# EAGLE schematic GEVCU-4.2 (EAGLE 6.1)
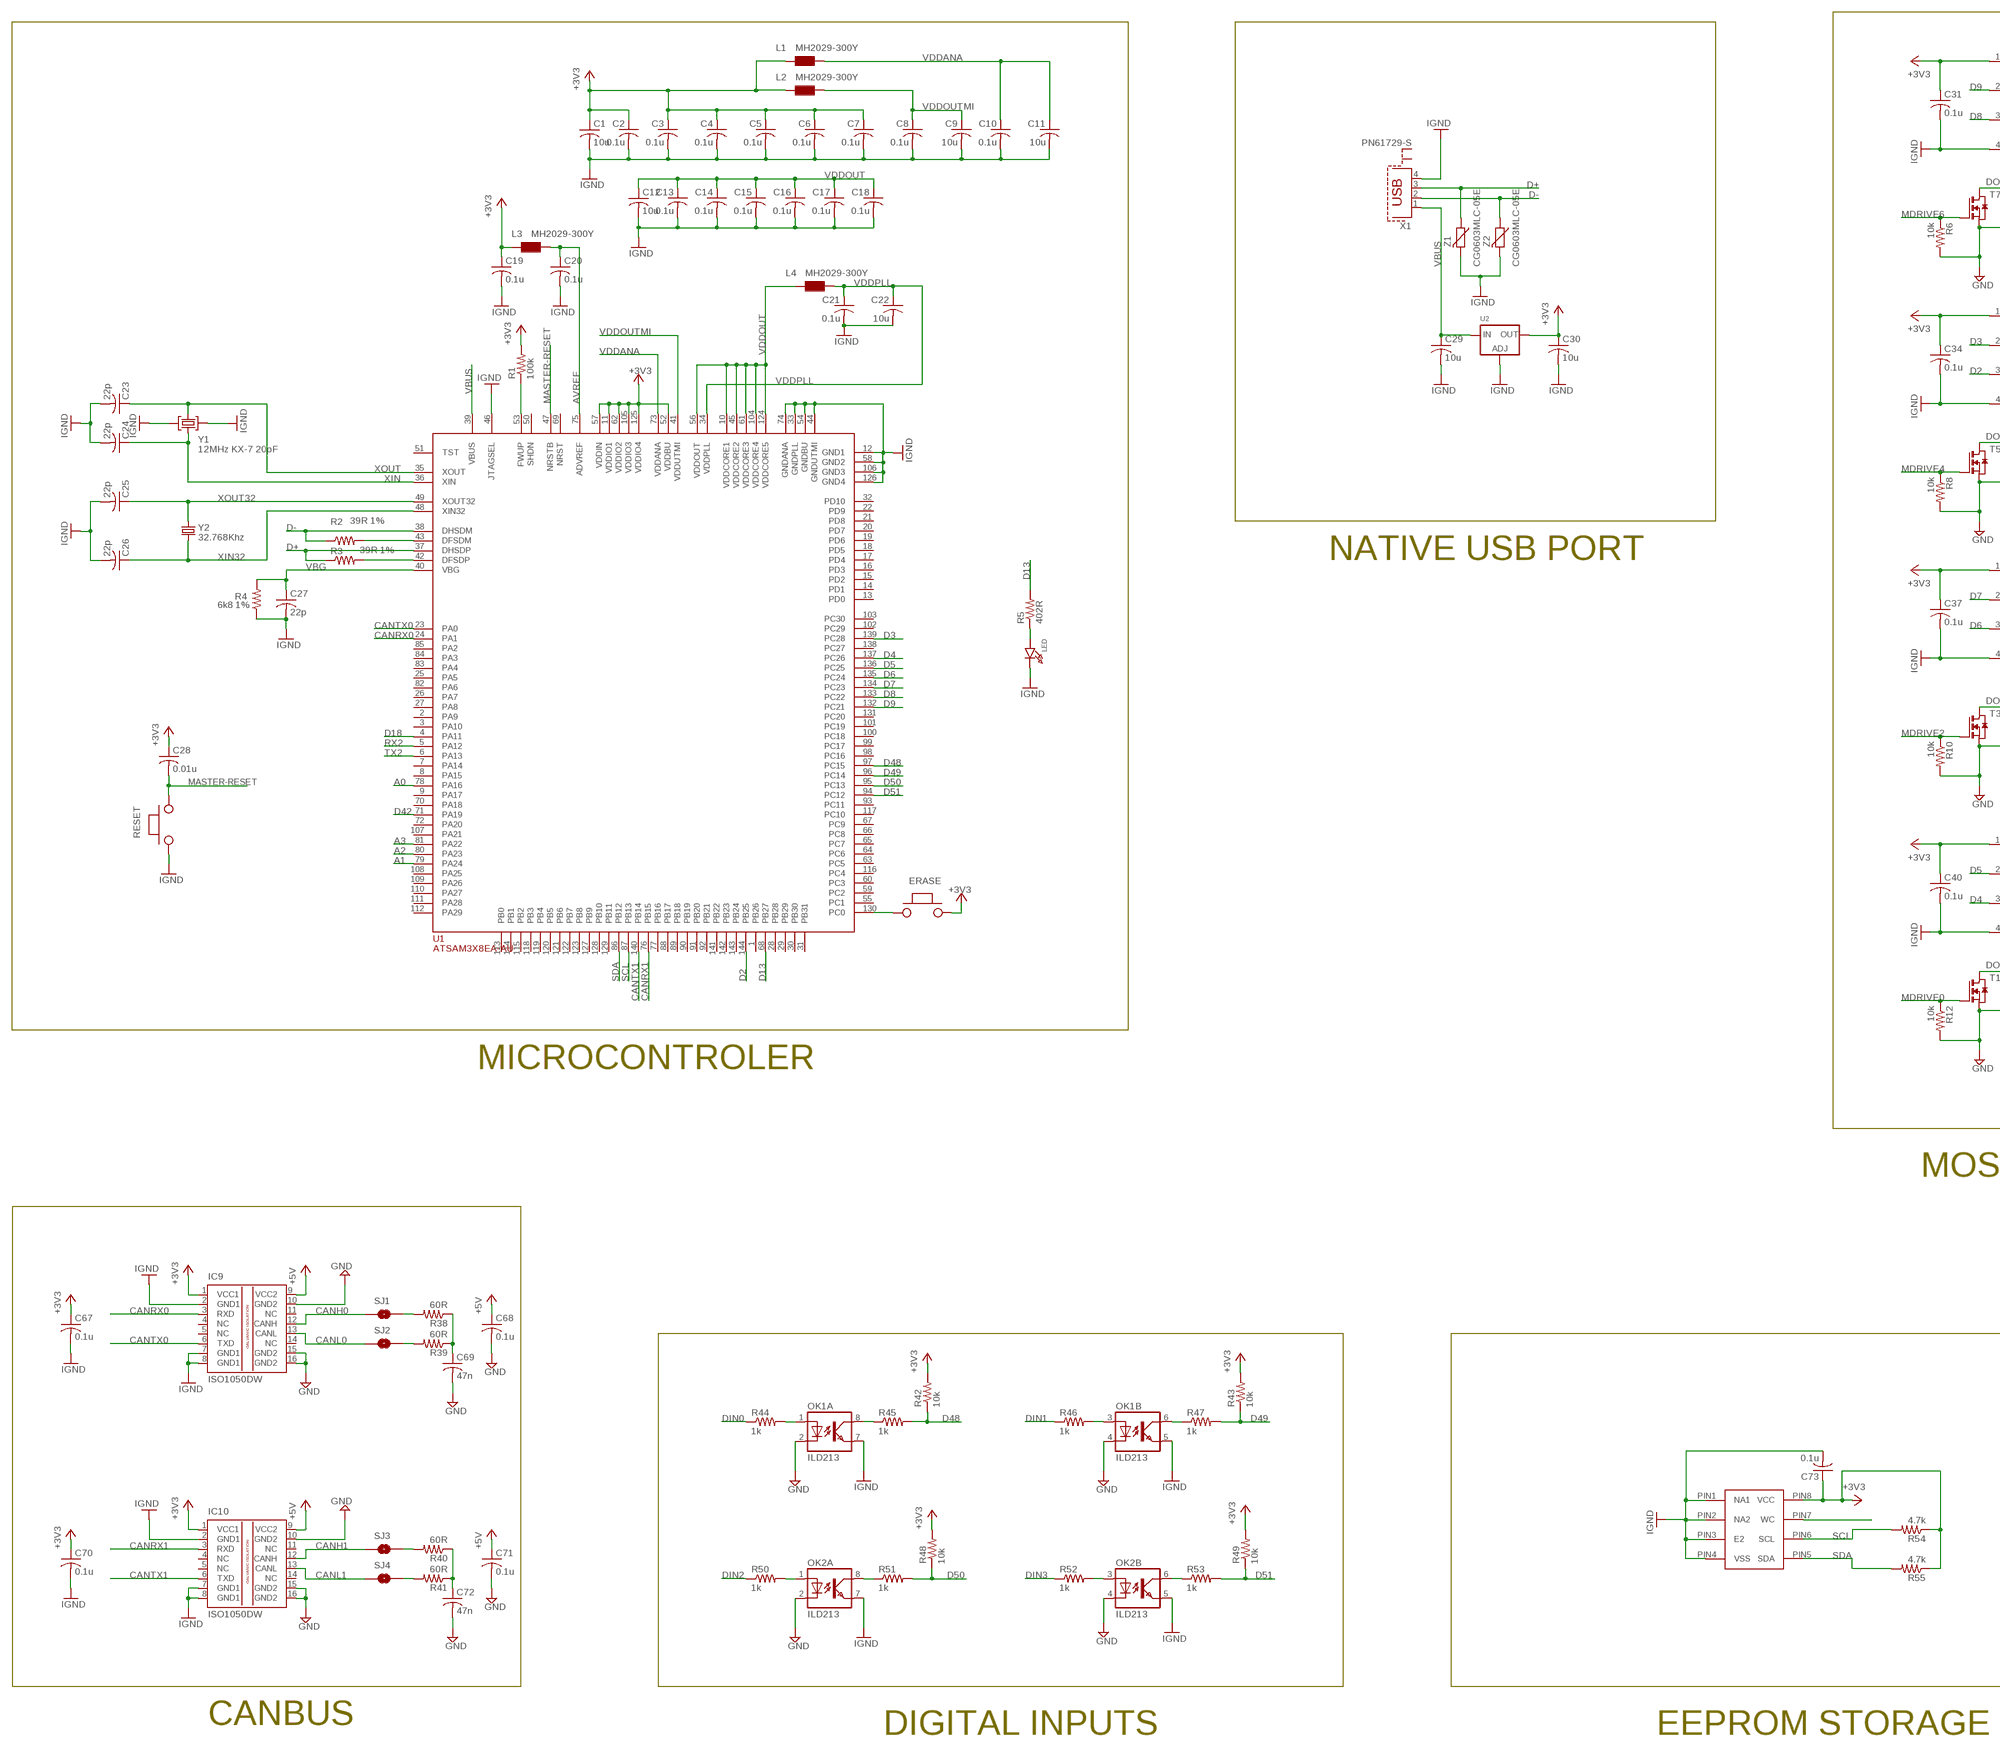
[diagram p0: schematic, sheet 1, part 1 of 2]
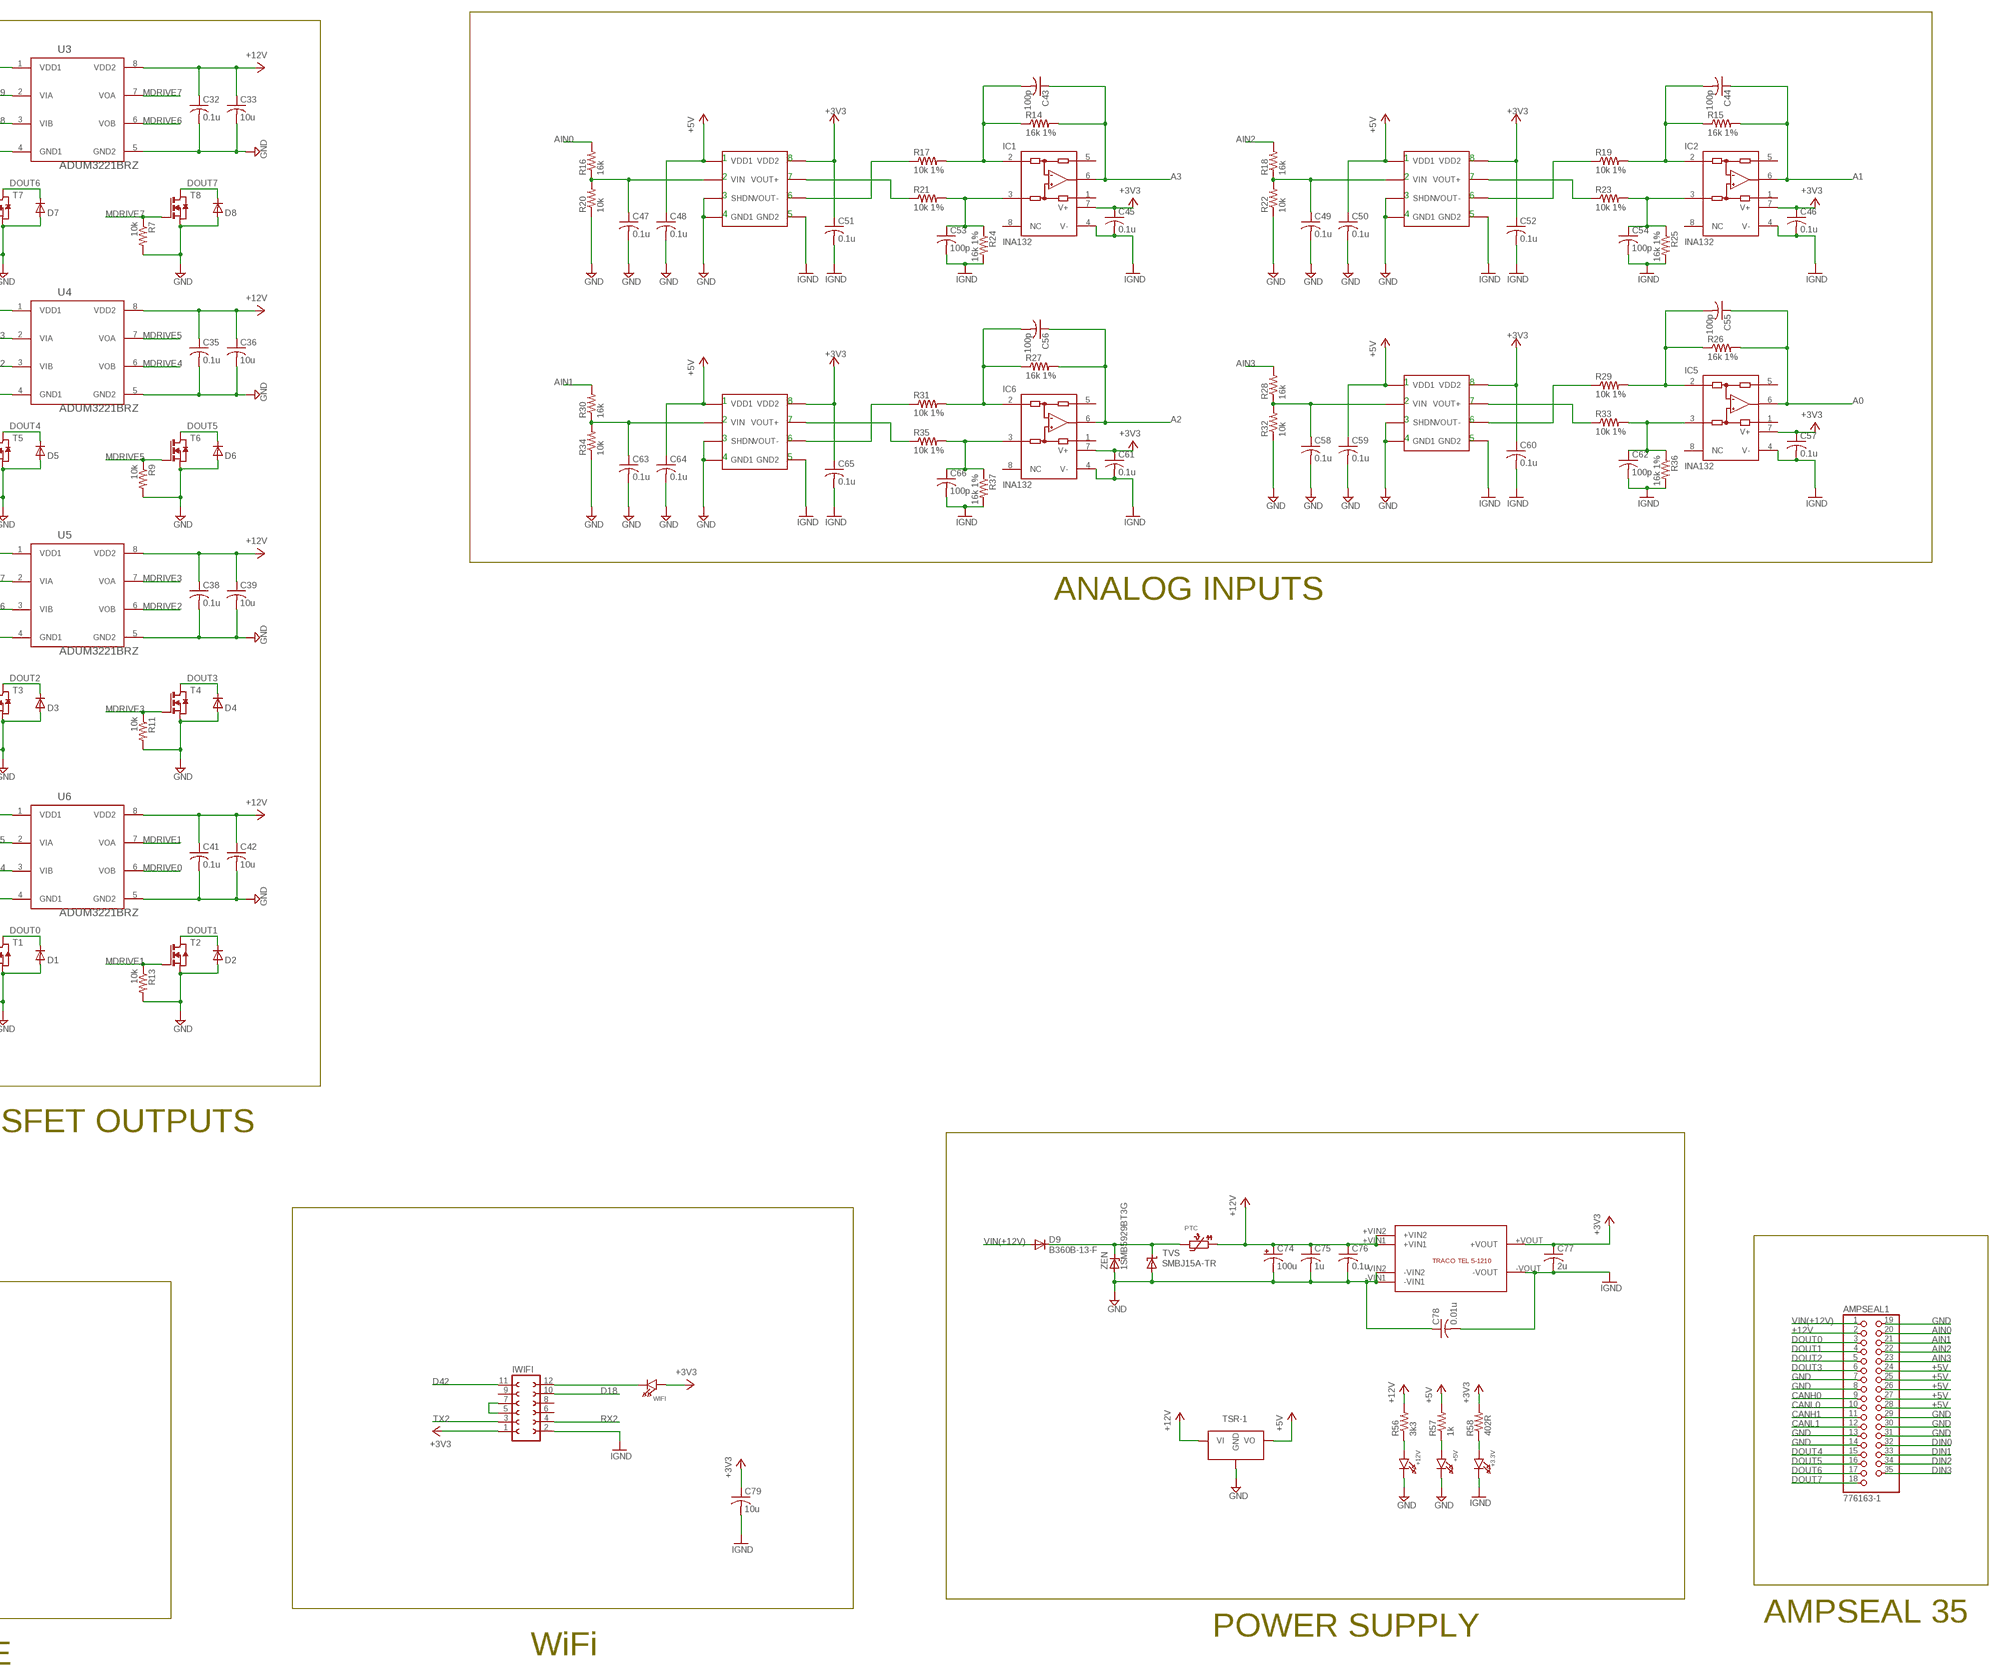
[diagram p1: schematic, sheet 1, part 2 of 2]

## Parts
+3.3V  LED0805  [CHIPLED_0805]
+5V  LED0805  [CHIPLED_0805]
+12V  LED0805  [CHIPLED_0805]
AMPSEAL1  776163-1  AMPSEAL35  [AMPSEAL35]
C1  10u  C-USC0805  [C0805]
C2  0.1u  C-USC0805  [C0805]
C3  0.1u  C-USC0805  [C0805]
C4  0.1u  C-USC0805  [C0805]
C5  0.1u  C-USC0805  [C0805]
C6  0.1u  C-USC0805  [C0805]
C7  0.1u  C-USC0805  [C0805]
C8  0.1u  C-USC0805  [C0805]
C9  10u  C-USC0805  [C0805]
C10  0.1u  C-USC0805  [C0805]
C11  10u  C-USC0805  [C0805]
C12  10u  C-USC0805  [C0805]
C13  0.1u  C-USC0805  [C0805]
C14  0.1u  C-USC0805  [C0805]
C15  0.1u  C-USC0805  [C0805]
C16  0.1u  C-USC0805  [C0805]
C17  0.1u  C-USC0805  [C0805]
C18  0.1u  C-USC0805  [C0805]
C19  0.1u  C-USC0805  [C0805]
C20  0.1u  C-USC0805  [C0805]
C21  0.1u  C-USC0805  [C0805]
C22  10u  C-USC0805  [C0805]
C23  22p  C-USC1206  [C1206]
C24  22p  C-USC1206  [C1206]
C25  22p  C-USC0805  [C0805]
C26  22p  C-USC0805  [C0805]
C27  22p  C-USC0805  [C0805]
C28  0.01u  C-USC0805  [C0805]
C29  10u  C-USC0805  [C0805]
C30  10u  C-USC0805  [C0805]
C31  0.1u  C-USC0805  [C0805]
C32  0.1u  C-USC0805  [C0805]
C33  10u  C-USC0805  [C0805]
C34  0.1u  C-USC0805  [C0805]
C35  0.1u  C-USC0805  [C0805]
C36  10u  C-USC0805  [C0805]
C37  0.1u  C-USC0805  [C0805]
C38  0.1u  C-USC0805  [C0805]
C39  10u  C-USC0805  [C0805]
C40  0.1u  C-USC0805  [C0805]
C41  0.1u  C-USC0805  [C0805]
C42  10u  C-USC0805  [C0805]
C43  100p  C-USC0805  [C0805]
C44  100p  C-USC0805  [C0805]
C45  0.1u  C-USC0805  [C0805]
C46  0.1u  C-USC0805  [C0805]
C47  0.1u  C-USC0805  [C0805]
C48  0.1u  C-USC1206  [C1206]
C49  0.1u  C-USC0805  [C0805]
C50  0.1u  C-USC1206  [C1206]
C51  0.1u  C-USC0805  [C0805]
C52  0.1u  C-USC0805  [C0805]
C53  100p  C-USC0805  [C0805]
C54  100p  C-USC0805  [C0805]
C55  100p  C-USC0805  [C0805]
C56  100p  C-USC0805  [C0805]
C57  0.1u  C-USC0805  [C0805]
C58  0.1u  C-USC0805  [C0805]
C59  0.1u  C-USC1206  [C1206]
C60  0.1u  C-USC0805  [C0805]
C61  0.1u  C-USC0805  [C0805]
C62  100p  C-USC0805  [C0805]
C63  0.1u  C-USC0805  [C0805]
C64  0.1u  C-USC1206  [C1206]
C65  0.1u  C-USC0805  [C0805]
C66  100p  C-USC0805  [C0805]
C67  0.1u  C-USC0805  [C0805]
C68  0.1u  C-USC0805  [C0805]
C69  47n  C-USC0805  [C0805]
C70  0.1u  C-USC0805  [C0805]
C71  0.1u  C-USC0805  [C0805]
C72  47n  C-USC0805  [C0805]
C73  0.1u  C-USC0805  [C0805]
C74  100u  CPOL-USE2.5-6  [E2,5-6]
C75  1u  C-USC0805  [C0805]
C76  0.1u  C-USC0805  [C0805]
C77  2u  C-USC0805  [C0805]
C78  0.01u  C-USC1812  [C1812]
C79  10u  C-USC0805  [C0805]
D1  MBR0520LT  [SOD123]
D2  MBR0520LT  [SOD123]
D3  MBR0520LT  [SOD123]
D4  MBR0520LT  [SOD123]
D5  MBR0520LT  [SOD123]
D6  MBR0520LT  [SOD123]
D7  MBR0520LT  [SOD123]
D8  MBR0520LT  [SOD123]
D9  B360B-13-F  DIODE-SMB  [SMB]
ERASE  PUCHBUTTON  [PUCHBUTTON]
IC1  INA132  INA105U  [SO08]
IC2  INA132  INA105U  [SO08]
IC3  CK_CUSTOM_ACPL-C87A-000E  [CK_CUSTOM_SO8-WIDE]
IC4  CK_CUSTOM_ACPL-C87A-000E  [CK_CUSTOM_SO8-WIDE]
IC5  INA132  INA105U  [SO08]
IC6  INA132  INA105U  [SO08]
IC7  CK_CUSTOM_ACPL-C87A-000E  [CK_CUSTOM_SO8-WIDE]
IC8  CK_CUSTOM_ACPL-C87A-000E  [CK_CUSTOM_SO8-WIDE]
IC9  ISO1050DW  ISO1050DUB  [DUB-R-PDSO-G8]
IC10  ISO1050DW  ISO1050DUB  [DUB-R-PDSO-G8]
IWIFI  FE06-2  [FE06-2]
L1  MH2029-300Y  WE-CBF_0805  [0805]
L2  MH2029-300Y  WE-CBF_0805  [0805]
L3  MH2029-300Y  WE-CBF_0805  [0805]
L4  MH2029-300Y  WE-CBF_0805  [0805]
LED  LED0805  [CHIPLED_0805]
OK1  ILD213  [SOIC08]
OK2  ILD213  [SOIC08]
PTC  PTC1812  [PTC1812]
R1  100k  R-US_R0805  [R0805]
R2  39R 1%  R-US_R0805  [R0805]
R3  39R 1%  R-US_R0805  [R0805]
R4  6k8 1%  R-US_R0805  [R0805]
R5  402R  R-US_R0805  [R0805]
R6  10k  R-US_R0805  [R0805]
R7  10k  R-US_R0805  [R0805]
R8  10k  R-US_R0805  [R0805]
R9  10k  R-US_R0805  [R0805]
R10  10k  R-US_R0805  [R0805]
R11  10k  R-US_R0805  [R0805]
R12  10k  R-US_R0805  [R0805]
R13  10k  R-US_R0805  [R0805]
R14  16k 1%  R-US_R0805  [R0805]
R15  16k 1%  R-US_R0805  [R0805]
R16  16k  R-US_R0805  [R0805]
R17  10k 1%  R-US_R0805  [R0805]
R18  16k  R-US_R0805  [R0805]
R19  10k 1%  R-US_R0805  [R0805]
R20  10k  R-US_R0805  [R0805]
R21  10k 1%  R-US_R0805  [R0805]
R22  10k  R-US_R0805  [R0805]
R23  10k 1%  R-US_R0805  [R0805]
R24  16k 1%  R-US_R0805  [R0805]
R25  16k 1%  R-US_R0805  [R0805]
R26  16k 1%  R-US_R0805  [R0805]
R27  16k 1%  R-US_R0805  [R0805]
R28  16k  R-US_R0805  [R0805]
R29  10k 1%  R-US_R0805  [R0805]
R30  16k  R-US_R0805  [R0805]
R31  10k 1%  R-US_R0805  [R0805]
R32  10k  R-US_R0805  [R0805]
R33  10k 1%  R-US_R0805  [R0805]
R34  10k  R-US_R0805  [R0805]
R35  10k 1%  R-US_R0805  [R0805]
R36  16k 1%  R-US_R0805  [R0805]
R37  16k 1%  R-US_R0805  [R0805]
R38  60R  R-US_R0805  [R0805]
R39  60R  R-US_R0805  [R0805]
R40  60R  R-US_R0805  [R0805]
R41  60R  R-US_R0805  [R0805]
R42  10k  R-US_R0805  [R0805]
R43  10k  R-US_R0805  [R0805]
R44  1k  R-US_R0805  [R0805]
R45  1k  R-US_R0805  [R0805]
R46  1k  R-US_R0805  [R0805]
R47  1k  R-US_R0805  [R0805]
R48  10k  R-US_R0805  [R0805]
R49  10k  R-US_R0805  [R0805]
R50  1k  R-US_R0805  [R0805]
R51  1k  R-US_R0805  [R0805]
R52  1k  R-US_R0805  [R0805]
R53  1k  R-US_R0805  [R0805]
R54  4.7k  R-US_R0805  [R0805]
R55  4.7k  R-US_R0805  [R0805]
R56  3k3  R-US_R0805  [R0805]
R57  1k  R-US_R0805  [R0805]
R58  402R  R-US_R0805  [R0805]
RESET  PUCHBUTTON  [PUCHBUTTON]
SJ1  SOLDERJUMPERNO  [SJ_2S-NO]
SJ2  SOLDERJUMPERNO  [SJ_2S-NO]
SJ3  SOLDERJUMPERNO  [SJ_2S-NO]
SJ4  SOLDERJUMPERNO  [SJ_2S-NO]
T1  NMOSSOT223  [SOT223]
T2  NMOSSOT223  [SOT223]
T3  NMOSSOT223  [SOT223]
T4  NMOSSOT223  [SOT223]
T5  NMOSSOT223  [SOT223]
T6  NMOSSOT223  [SOT223]
T7  NMOSSOT223  [SOT223]
T8  NMOSSOT223  [SOT223]
TVS  SMBJ15A-TR  SUPPRESSOR-SMBJ  [SMBJ]
U1  ATSAM3X8EA-AU  ATSAM3X/AAU  [LQFP144]
U2  LM1117SOT223-WAVE  [SOT223-W]
U3  ADUM3221BRZ  [SOIC127P600X175-8N]
U4  ADUM3221BRZ  [SOIC127P600X175-8N]
U5  ADUM3221BRZ  [SOIC127P600X175-8N]
U6  ADUM3221BRZ  [SOIC127P600X175-8N]
U7  CK_CUSTOM_M24M02-DRMN6TP  [CK_CUSTOM_SOIC8]
U8  TRACO  [TRACO]
U9  TSR-1  [TSR-1]
WIFI  LED0805  [CHIPLED_0805]
X1  PN61729-S  [PN61729-S]
Y1  12MHz KX-7 20pF  CRYSTAL-3.2-2.5  [CRYSTAL-3.2-2.5]
Y2  32.768Khz  ARDUINO_WIFI_SHIELD_V018_TG_RESONATOR_EPSON_FC_145  [ARDUINO_WIFI_SHIELD_V018_TG_RESONATOR_EPSON_FC_145]
Z1  CG0603MLC-05E  VARISTORCN0603  [CT/CN0603]
Z2  CG0603MLC-05E  VARISTORCN0603  [CT/CN0603]
ZEN  1SMB5929BT3G  ZENER-DIODESMB  [SMB]

## Nets
+3V3: C1.1 C2.1 C3.1 C4.1 C5.1 C6.1 C7.1 C19.1 C28.1 C30.1 C31.1 C34.1 C37.1 C40.1 C45.1 C46.1 C51.1 C52.1 C57.1 C60.1 C61.1 C65.1 C67.1 C70.1 C73.1 C77.1 C79.1 ERASE.P$2 IC1.7(V+) IC2.7(V+) IC3.8(VDD2) IC4.8(VDD2) IC5.7(V+) IC6.7(V+) IC7.8(VDD2) IC8.8(VDD2) IC9.1(VCC1) IC10.1(VCC1) IWIFI.1 L1.1 L2.1 L3.1 R1.2 R42.2 R43.2 R48.2 R49.2 R54.1 R55.1 R58.2 U1.11(VDDIO1) U1.52(VDDBU) U1.57(VDDIN) U1.62(VDDIO2) U1.105(VDDIO3) U1.125(VDDIO4) U2.2(OUT) U3.1(VDD1) U4.1(VDD1) U5.1(VDD1) U6.1(VDD1) U7.PIN8(VCC) U8.+VOUT WIFI.A
+5V: AMPSEAL1.24 AMPSEAL1.25 AMPSEAL1.26 AMPSEAL1.27 AMPSEAL1.28 C48.1 C50.1 C59.1 C64.1 C68.1 C71.1 IC3.1(VDD1) IC4.1(VDD1) IC7.1(VDD1) IC8.1(VDD1) IC9.9(VCC2) IC10.9(VCC2) R57.2 U9.P$3(VO)
+12V: AMPSEAL1.2 C32.1 C33.1 C35.1 C36.1 C38.1 C39.1 C41.1 C42.1 C74.+ C75.1 C76.1 PTC.P$1 R56.2 U3.8(VDD2) U4.8(VDD2) U5.8(VDD2) U6.8(VDD2) U8.+VIN1 U8.+VIN2 U9.P$1(VI)
A0: C55.1 IC5.6(OUT) R26.2 U1.78(PA16)
A1: C44.1 IC2.6(OUT) R15.2 U1.79(PA24)
A2: C56.1 IC6.6(OUT) R27.2 U1.80(PA23)
A3: C43.1 IC1.6(OUT) R14.2 U1.81(PA22)
AIN0: AMPSEAL1.20 R16.2
AIN1: AMPSEAL1.21 R30.2
AIN2: AMPSEAL1.22 R18.2
AIN3: AMPSEAL1.23 R28.2
AVREF: C20.1 L3.2 U1.75(ADVREF)
CANH0: AMPSEAL1.9 IC9.12(CANH) SJ1.1
CANH1: AMPSEAL1.11 IC10.12(CANH) SJ3.1
CANL0: AMPSEAL1.10 IC9.13(CANL) SJ2.1
CANL1: AMPSEAL1.12 IC10.13(CANL) SJ4.1
CANRX0: IC9.3(RXD) U1.24(PA1)
CANRX1: IC10.3(RXD) U1.76(PB15)
CANTX0: IC9.6(TXD) U1.23(PA0)
CANTX1: IC10.6(TXD) U1.140(PB14)
D2: U1.144(PB25) U4.3(VIB)
D3: U1.139(PC28) U4.2(VIA)
D4: U1.137(PC26) U6.3(VIB)
D5: U1.136(PC25) U6.2(VIA)
D6: U1.135(PC24) U5.3(VIB)
D7: U1.134(PC23) U5.2(VIA)
D8: U1.133(PC22) U3.3(VIB)
D9: U1.132(PC21) U3.2(VIA)
D13: R5.2 U1.68(PB27)
D18: IWIFI.10 U1.4(PA11)
D42: IWIFI.11 U1.71(PA19)
D48: R42.1 R45.2 U1.97(PC15)
D49: R43.1 R47.2 U1.96(PC14)
D50: R48.1 R51.2 U1.95(PC13)
D51: R49.1 R53.2 U1.94(PC12)
D+ [USB]: R3.1 U1.37(DHSDP) X1.3 Z1.1
D- [USB]: R2.1 U1.38(DHSDM) X1.2 Z2.1
DIN0: AMPSEAL1.32 R44.1
DIN1: AMPSEAL1.33 R46.1
DIN2: AMPSEAL1.34 R50.1
DIN3: AMPSEAL1.35 R52.1
DOUT0: AMPSEAL1.3 D1.C T1.2(D) T1.4(D)
DOUT1: AMPSEAL1.4 D2.C T2.2(D) T2.4(D)
DOUT2: AMPSEAL1.5 D3.C T3.2(D) T3.4(D)
DOUT3: AMPSEAL1.6 D4.C T4.2(D) T4.4(D)
DOUT4: AMPSEAL1.15 D5.C T5.2(D) T5.4(D)
DOUT5: AMPSEAL1.16 D6.C T6.2(D) T6.4(D)
DOUT6: AMPSEAL1.17 D7.C T7.2(D) T7.4(D)
DOUT7: AMPSEAL1.18 D8.C T8.2(D) T8.4(D)
ERASE_S: ERASE.P$1 U1.130(PC0)
GND: +5V.C +12V.C AMPSEAL1.7 AMPSEAL1.8 AMPSEAL1.13 AMPSEAL1.14 AMPSEAL1.19 AMPSEAL1.29 AMPSEAL1.30 AMPSEAL1.31 C32.2 C33.2 C35.2 C36.2 C38.2 C39.2 C41.2 C42.2 C47.2 C48.2 C49.2 C50.2 C58.2 C59.2 C63.2 C64.2 C68.2 C69.2 C71.2 C72.2 C74.- C75.2 C76.2 C78.1 D1.A D2.A D3.A D4.A D5.A D6.A D7.A D8.A IC3.3(SHDN) IC3.4(GND1) IC4.3(SHDN) IC4.4(GND1) IC7.3(SHDN) IC7.4(GND1) IC8.3(SHDN) IC8.4(GND1) IC9.10(GND2) IC9.15(GND2) IC9.16(GND2) IC10.10(GND2) IC10.15(GND2) IC10.16(GND2) OK1.2(A:C) OK1.4(B:C) OK2.2(A:C) OK2.4(B:C) R6.2 R7.2 R8.2 R9.2 R10.2 R11.2 R12.2 R13.2 R20.1 R22.1 R32.1 R34.1 T1.3(S) T2.3(S) T3.3(S) T4.3(S) T5.3(S) T6.3(S) T7.3(S) T8.3(S) TVS.A U3.5(GND2) U4.5(GND2) U5.5(GND2) U6.5(GND2) U8.-VIN1 U8.-VIN2 U9.P$2(GND) ZEN.A
IGND: +3.3V.C C1.2 C2.2 C3.2 C4.2 C5.2 C6.2 C7.2 C8.2 C9.2 C10.2 C11.2 C12.2 C13.2 C14.2 C15.2 C16.2 C17.2 C18.2 C19.2 C20.2 C21.2 C22.2 C23.2 C24.2 C25.2 C26.2 C27.2 C29.2 C30.2 C31.2 C34.2 C37.2 C40.2 C45.2 C46.2 C51.2 C52.2 C53.2 C54.2 C57.2 C60.2 C61.2 C62.2 C65.2 C66.2 C67.2 C70.2 C73.2 C77.2 C78.2 C79.2 IC1.4(V-) IC2.4(V-) IC3.5(GND2) IC4.5(GND2) IC5.4(V-) IC6.4(V-) IC7.5(GND2) IC8.5(GND2) IC9.2(GND1) IC9.7(GND1) IC9.8(GND1) IC10.2(GND1) IC10.7(GND1) IC10.8(GND1) IWIFI.2 LED.C OK1.5(B:EMIT) OK1.7(A:EMIT) OK2.5(B:EMIT) OK2.7(A:EMIT) R4.1 R24.2 R25.2 R36.2 R37.2 RESET.P$1 U1.12(GND1) U1.33(GNDPLL) U1.44(GNDUTMI) U1.46(JTAGSEL) U1.54(GNDBU) U1.58(GND2) U1.74(GNDANA) U1.106(GND3) U1.126(GND4) U2.1(ADJ) U3.4(GND1) U4.4(GND1) U5.4(GND1) U6.4(GND1) U7.PIN1(NA1) U7.PIN2(NA2) U7.PIN3(E2) U7.PIN4(VSS) U8.-VOUT X1.4 Y1.2(GND) Y1.4(GND) Z1.2 Z2.2
MASTER-RESET: C28.2 RESET.P$2 U1.47(NRSTB)
MDRIVE0: R12.1 T1.1(G) U6.6(VOB)
MDRIVE1: R13.1 T2.1(G) U6.7(VOA)
MDRIVE2: R10.1 T3.1(G) U5.6(VOB)
MDRIVE3: R11.1 T4.1(G) U5.7(VOA)
MDRIVE4: R8.1 T5.1(G) U4.6(VOB)
MDRIVE5: R9.1 T6.1(G) U4.7(VOA)
MDRIVE6: R6.1 T7.1(G) U3.6(VOB)
MDRIVE7: R7.1 T8.1(G) U3.7(VOA)
N$1: C47.1 IC3.2(VIN) R16.1 R20.2
N$2: +3.3V.A R58.1
N$3: D9.C PTC.P$2 TVS.C ZEN.C
N$4: +5V.A R57.1
N$6: LED.A R5.1
N$8: IC8.7(VOUT+) R35.1
N$9: IC8.6(VOUT-) R31.1
N$12: C56.2 IC6.2(-IN) R27.1 R31.2
N$13: IC3.7(VOUT+) R21.1
N$14: IC3.6(VOUT-) R17.1
N$15: C43.2 IC1.2(-IN) R14.1 R17.2
N$16: C53.1 IC1.3(+IN) R21.2 R24.1
N$17: C66.1 IC6.3(+IN) R35.2 R37.1
N$18: C63.1 IC8.2(VIN) R30.1 R34.2
N$19: IC4.7(VOUT+) R23.1
N$20: IC4.6(VOUT-) R19.1
N$21: C44.2 IC2.2(-IN) R15.1 R19.2
N$22: C54.1 IC2.3(+IN) R23.2 R25.1
N$23: C49.1 IC4.2(VIN) R18.1 R22.2
N$24: C69.1 R38.1 R39.1
N$25: IC7.7(VOUT+) R33.1
N$26: R38.2 SJ1.2
N$27: R39.2 SJ2.2
N$28: R41.2 SJ4.2
N$29: C72.1 R40.1 R41.1
N$30: R40.2 SJ3.2
N$31: OK1.1(A:A) R44.2
N$32: OK1.3(B:A) R46.2
N$33: OK1.8(A:COL) R45.1
N$34: OK1.6(B:COL) R47.1
N$35: IC7.6(VOUT-) R29.1
N$36: OK2.6(B:COL) R53.1
N$37: C55.2 IC5.2(-IN) R26.1 R29.2
N$38: OK2.8(A:COL) R51.1
N$39: C62.1 IC5.3(+IN) R33.2 R36.1
N$40: OK2.1(A:A) R50.2
N$41: C58.1 IC7.2(VIN) R28.1 R32.2
N$43: OK2.3(B:A) R52.2
N$44: +12V.A R56.1
N$45: IWIFI.12 WIFI.C
N$49: IWIFI.5 IWIFI.7
N$53: R2.2 U1.43(DFSDM)
N$56: R3.2 U1.42(DFSDP)
N$59: R1.1 U1.53(FWUP)
RX2: IWIFI.4 U1.5(PA12)
RXD1: U7.PIN7(WC)
SCL: R54.2 U1.87(PB13) U7.PIN6(SCL)
SDA: R55.2 U1.86(PB12) U7.PIN5(SDA)
TX2: IWIFI.3 U1.6(PA13)
VBG: C27.1 R4.2 U1.40(VBG)
VBUS [usbvcc]: C29.1 U1.39(VBUS) U2.3(IN) X1.1
VDDANA: C10.1 C11.1 L1.2 U1.73(VDDANA)
VDDOUT: C12.1 C13.1 C14.1 C15.1 C16.1 C17.1 C18.1 L4.1 U1.10(VDDCORE1) U1.45(VDDCORE2) U1.56(VDDOUT) U1.61(VDDCORE3) U1.104(VDDCORE4) U1.124(VDDCORE5)
VDDOUTMI: C8.1 C9.1 L2.2 U1.41(VDDUTMI)
VDDPLL: C21.1 C22.1 L4.2 U1.34(VDDPLL)
VIN(+12V): AMPSEAL1.1 D9.A
XIN: C24.1 U1.36(XIN) Y1.1(C1)
XIN32: C26.1 U1.48(XIN32) Y2.P$2
XOUT: C23.1 U1.35(XOUT) Y1.3(C2)
XOUT32: C25.1 U1.49(XOUT32) Y2.P$1
Unconnected: IC1.1(REF) IC1.5(SENSE) IC1.8(NC) IC2.1(REF) IC2.5(SENSE) IC2.8(NC) IC5.1(REF) IC5.5(SENSE) IC5.8(NC) IC6.1(REF) IC6.5(SENSE) IC6.8(NC) IC9.4(NC) IC9.5(NC) IC9.11(NC) IC9.14(NC) IC10.4(NC) IC10.5(NC) IC10.11(NC) IC10.14(NC) IWIFI.6 IWIFI.8 IWIFI.9 U1.1(PB26) U1.2(PA9) U1.3(PA10) U1.7(PA14) U1.8(PA15) U1.9(PA17) U1.13(PD0) U1.14(PD1) U1.15(PD2) U1.16(PD3) U1.17(PD4) U1.18(PD5) U1.19(PD6) U1.20(PD7) U1.21(PD8) U1.22(PD9) U1.25(PA5) U1.26(PA7) U1.27(PA8) U1.28(PB28) U1.29(PB29) U1.30(PB30) U1.31(PB31) U1.32(PD10) U1.50(SHDN) U1.51(TST) U1.55(PC1) U1.59(PC2) U1.60(PC3) U1.63(PC5) U1.64(PC6) U1.65(PC7) U1.66(PC8) U1.67(PC9) U1.69(NRST) U1.70(PA18) U1.72(PA20) U1.77(PB16) U1.82(PA6) U1.83(PA4) U1.84(PA3) U1.85(PA2) U1.88(PB17) U1.89(PB18) U1.90(PB19) U1.91(PB20) U1.92(PB21) U1.93(PC11) U1.98(PC16) U1.99(PC17) U1.100(PC18) U1.101(PC19) U1.102(PC29) U1.103(PC30) U1.107(PA21) U1.108(PA25) U1.109(PA26) U1.110(PA27) U1.111(PA28) U1.112(PA29) U1.113(PB0) U1.114(PB1) U1.115(PB2) U1.116(PC4) U1.117(PC10) U1.118(PB3) U1.119(PB4) U1.120(PB5) U1.121(PB6) U1.122(PB7) U1.123(PB8) U1.127(PB9) U1.128(PB10) U1.129(PB11) U1.131(PC20) U1.138(PC27) U1.141(PB22) U1.142(PB23) U1.143(PB24) X1.S1 X1.S2

## Notes on the sheet
- 1 | 8 | 1 | 8
- 2 | 7 | 2 | 7
- 3 | 6 | 3 | 6
- 4 | 5 | 4 | 5
- 1 | 8
- 1 | 8 | 2 | 7
- 2 | 7 | 3 | 6
- 3 | 6 | 4 | 5
- 4 | 5
- NATIVE USB PORT
- ANALOG INPUTS
- MICROCONTROLER
- MOSFET OUTPUTS
- AMPSEAL 35
- POWER SUPPLY
- CANBUS | DIGITAL INPUTS | EEPROM STORAGE | WiFi

## Library data of the parts
+3.3V +5V +12V LED WIFI = microbuilder:LED: LED 0603 - 0603 Surface Mount Package 2mA: Green LED - Low Power (3.9mcd, 2ma, 1.7Vf) - Digikey: 475-2709-2-ND Orange LED - Low Power (9.8mcd, 2ma, 1.8Vf) - Digikey: 475-1194-2-ND Red LED - Low Power (5mcd, 2ma, 1.8Vf) - Digikey: 475-1195-2-ND Yellow LED - Low Power (7mcd, 2ma, 1.8Vf) - Digikey: 475-1196-2-ND 5mA: Blue LED - Low Power (17mcd, 5ma, 2.9Vf) - Digikey: LNJ937W8CRACT-ND 0805 - 0805 Surface Mount Package 2mA: Red LED (8.8mcd, 2mA, 1.8Vf, Clear) - Low Power [Digikey: 475-2510-1-ND] Green LED (5mcd, 2mA, 1.8Vf, Clear) - Low Power [Digikey: 475-2730-1-ND] Yellow LED (11.3mcd, 2mA, 1.8Vf, Clear) - Low Power [Digikey: 475-2555-1-ND] 20mA: Red LED (104mcd, 20mA, Diffused) - LS R976 [Digikey: 475-1278-6-ND] Red LED (12mcd, 20mA, 2.0Vf, Clear) - APT2012EC [Digikey: 754-1128-1-ND] Green LED (15mcd, 20mA, 2.2Vf, Clear) - APT2012GC [Digikey: 754-1131-1-ND] Orange LED (160mcd, 20mA, 2.1Vf, Clear) - APT2012SECK [Digikey: 754-1130-1-ND] 1206 - 1206 Surface Mount Package Green LED (26mcd, 20mA, Diffused) - LG N971 [Digikey: 475-1407-6-ND] Red LED (15mcd, 20mA, Diffused) - LH N974 [Digikey: 475-1416-6-ND]
AMPSEAL1 = Ampseal:AMPSEAL35: Ampseal 35 pin PCB mount
C1-C73 C75-C79 = rcl:C-US: CAPACITOR, American symbol
C74 = rcl:CPOL-US: POLARIZED CAPACITOR, American symbol
D1-D8 = diode:MBR0520LT: SCHOTTKY BARRIER RECTIFIER Source: http://onsemi.com .. MBR0520LT1-D.pdf
D9 = diode:DIODE-: DIODE
ERASE = PushButton:PUCHBUTTON; BUTTON: ERASE; ERASE: Erase
IC1 IC2 IC5 IC6 = burr-brown:INA105: Precision Unity Gain Diff. Amplifier; MF: TEXAS INSTRUMENTS; MPN: INA105KU; OC_FARNELL: 1754832; OC_NEWARK: 35C0475
IC3 IC4 IC7 IC8 = ck_custom:CK_CUSTOM_ACPL-C87A-000E
IC9 IC10 = texas:ISO1050: ISOLATED CAN TRANSCEIVER Source: http://focus.ti.com/lit/ds/symlink/iso1050.pdf; MPN: ISO1050DW
IWIFI = con-lsta:FE06-2: FEMALE HEADER; OC_FARNELL: unknown; OC_NEWARK: unknown
L1-L4 = wuerth-elektronik:WE-CBF: SMD EMI Suppression Ferrite Beads - excellent anti-EMI properties - low DCR - impedances till 3000 ohms - rated current up to 6 A
OK1 OK2 = optocoupler:ILD2*: Siemens ILD205/206/207/211/213/217 DUAL PHOTOTRANSISTOR SMALL OUTLINE SURFACE MOUNT OPTOCOUPLER Source: 153385-da-01-en-Optocoupler_ILD205-T.pdf; MF: VISHAY/TELEFUNKEN; MPN: ILD213T; OC_FARNELL: 1045451; OC_NEWARK: 20H8680
PTC = microbuilder:PTC: PTC (Resettable Fuse) 1206 Package 250mA PTC (16V Max, Time-to-Trip: 0.08s) - Digikey: F2110CT-ND 1210 Package 100mA PTC (30V Max, Time-to-Trip: 0.6s) - Digikey: MF-USMF010-2CT-ND 1812 Package 750mA PTC (24V Max, Time-to-Trip: 0.2s) - Digikey: MF-MSMF075/24-2CT-ND
R1-R58 = rcl:R-US_: RESISTOR, American symbol
RESET = PushButton:PUCHBUTTON; BUTTON: RESET; RESET: RESET
SJ1-SJ4 = SparkFun-Passives:SOLDERJUMPER: Solder Jumper Standard SMD solder jumper. Used to automate production. Two varients : Normally Open and Normally Closed are the same, but have different paste layers. NC will have a large amount of paste and should jumper during reflow.
T1-T8 = zetex:NMOSSOT223: MOS FET; OC_FARNELL: unknown; OC_NEWARK: unknown
TVS = diode:SUPPRESSOR-: Suppressor diode
U1 = SmartPrj:ATSAM3X/A
U2 = microbuilder:LM1117: LM1117 Voltage Regulator LM1117 Adjustable Voltage regulator [Digikey: LM1117IMP-ADJDKR-ND] LM1117 3.3V Voltage regulator [AP1117E33GDIDKR-ND] LM1117 5.0V Voltage regulator [AP1117E50GDIDKR-ND] SOT223-REFLOW - SOT223 package for solder paste/reflow ovens SOT223-WAVE - SOT223 package for hand-soldering (larger pads) Note: For the fixed-voltage regulators, simply set the ADJ pin to GND.
U3-U6 = adum3221:ADUM3221BRZ: Dual Channel Gate Driver; MPN: ADUM3221BRZ; OC_FARNELL: 1897122; OC_NEWARK: 39T6549; PACKAGE: SOIC-8; SUPPLIER: ANALOG DEVICES
U7 = EPROM:CK_CUSTOM_M24M02-DRMN6TP
U8 = Traco:TRACO
U9 = Traco:TSR-1
X1 = con-berg:PN61729-S: BERG USB connector; OC_FARNELL: unknown; OC_NEWARK: unknown
Y1 = SmartPrj:CRYSTAL-3.2-2.5
Y2 = Arduino_Wifi_shield_v018_tG:ARDUINO_WIFI_SHIELD_V018_TG_RESONATOR_EPSON_FC_145
Z1 Z2 = varistor:VARISTOR: VARISTOR
ZEN = diode:ZENER-DIODE: Z-Diode

## Net classes
0 default: width 0.203 mm
1 USB: drill 0.406 mm, clearance 0.203 mm to class 0, clearance 0.406 mm
2 gnd: width 0.305 mm, drill 0.406 mm, clearance 0.203 mm to class 0, clearance 0.203 mm
3 usbvcc: width 0.61 mm, drill 0.508 mm, clearance 0.203 mm to class 0, clearance 0.254 mm